# EAGLE schematic PX4Isolator (EAGLE 6.5.0)

## Sheet 1 of 4
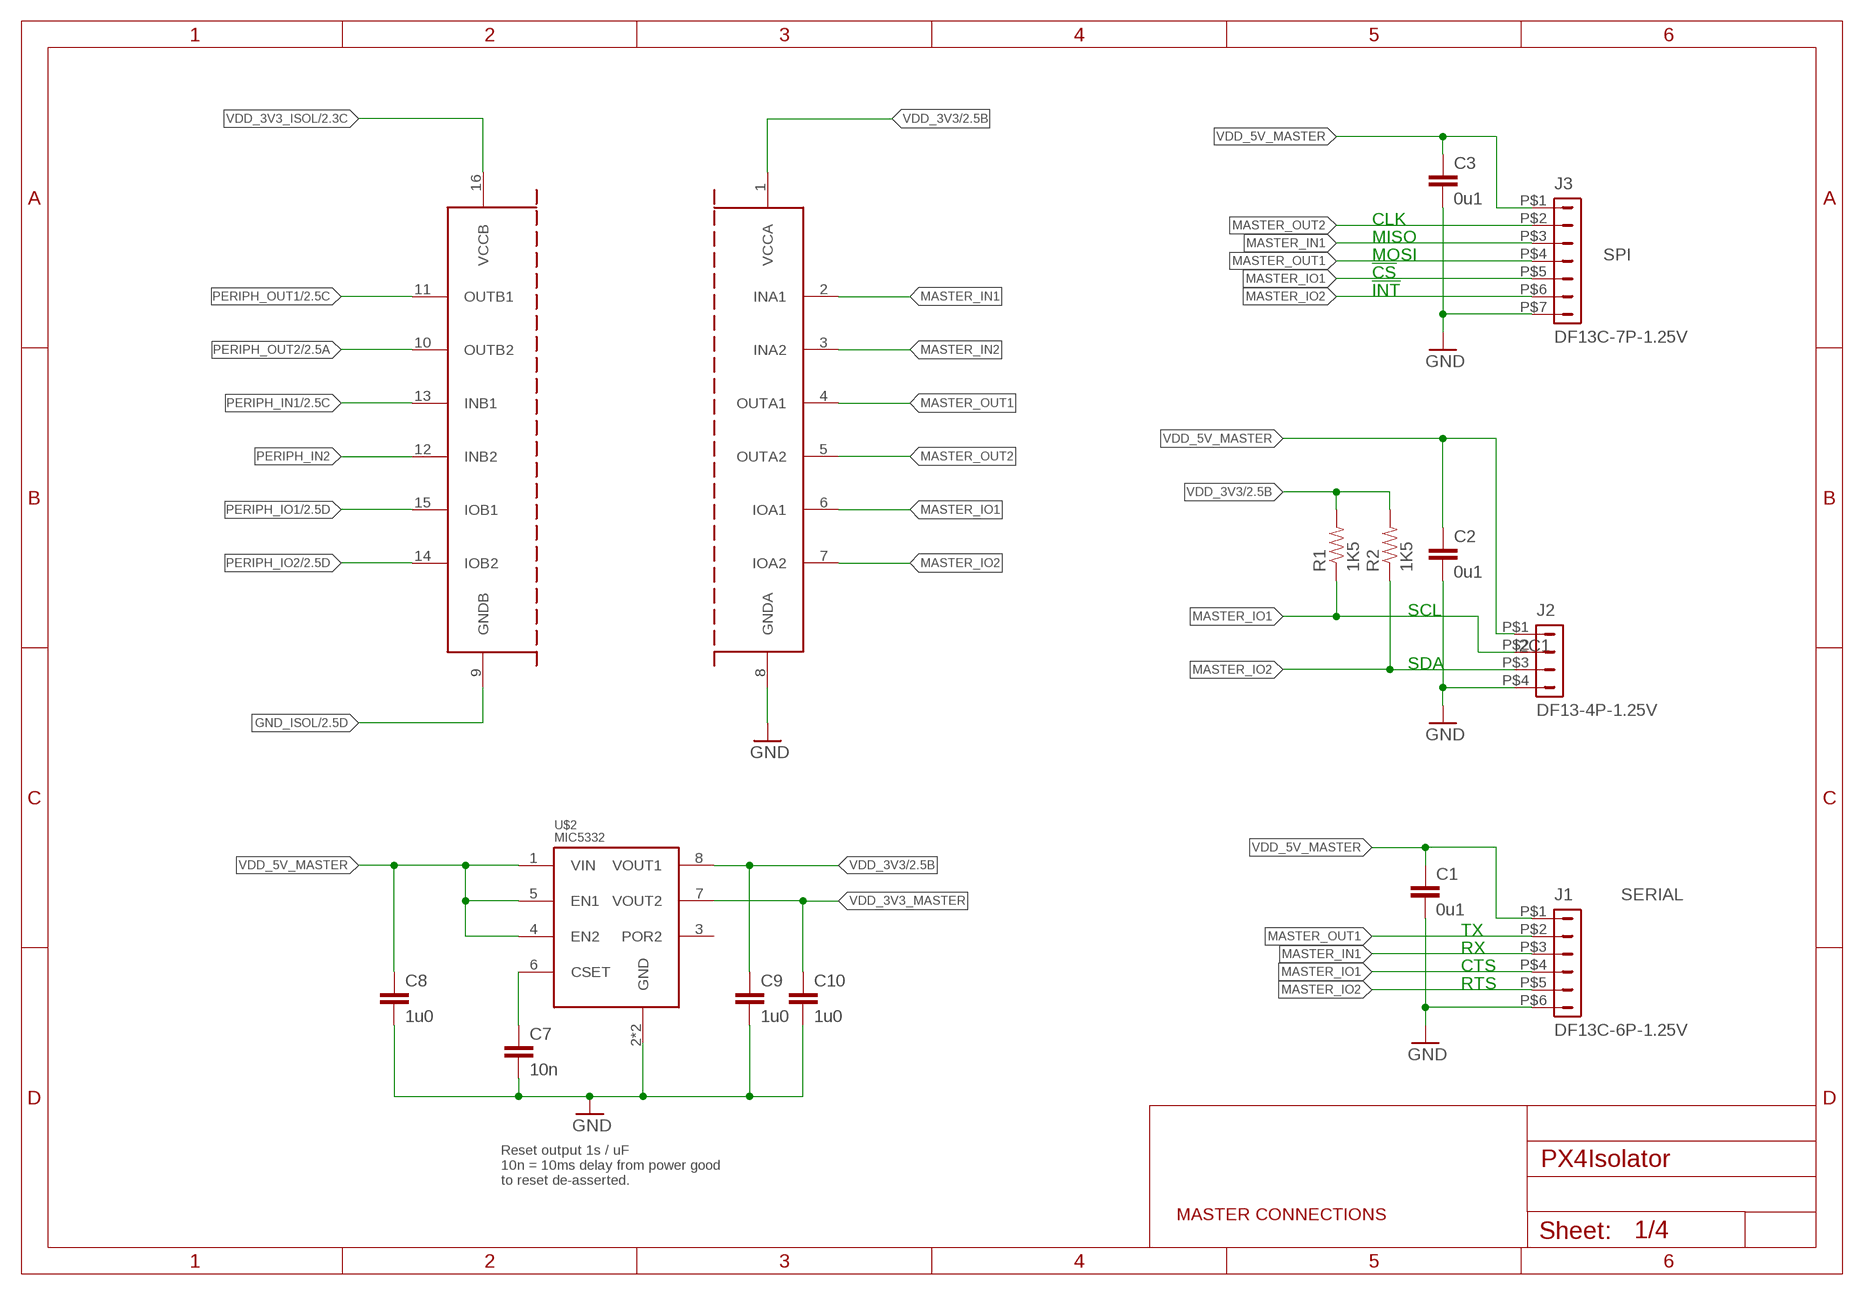
[diagram p0: schematic, sheet 1]

### Parts
C1  0u1  CAP0402  [0402-CAP]
C2  0u1  CAP0402  [0402-CAP]
C3  0u1  CAP0402  [0402-CAP]
C7  10n  CAP0402  [0402-CAP]
C8  1u0  CAP0603  [0603-CAP]
C9  1u0  CAP0603  [0603-CAP]
C10  1u0  CAP0603  [0603-CAP]
J1  DF13C-6P-1.25V  DF13-6P-1.25V  [DF13C-6P-1.25V]
J2  DF13-4P-1.25V  [DF13C-4P-1.25V]
J3  DF13C-7P-1.25V  DF13-7P-1.25V  [DF13C-7P-1.25V]
R1  1K5  RESISTOR0402-RES  [0402-RES]
R2  1K5  RESISTOR0402-RES  [0402-RES]
U$1  MAX14850  [SOIC16]
U$2  MIC5332  [MLF-8-EPAD]

### Nets
GND: C1.P$2 C2.P$2 C3.P$2 C7.P$2 C8.P$2 C9.P$2 C10.P$2 J1.P$6 J2.P$4 J3.P$7 U$1.8(GNDA) U$2.2(GND) U$2.GND ; also sheet 2,4
GND_ISOL [power]: U$1.9(GNDB) ; also sheet 2
MASTER_IN1: J1.P$3 J3.P$3 U$1.2(INA1)
MASTER_IN2: U$1.3(INA2)
MASTER_IO1: J1.P$4 J2.P$2 J3.P$5 R1.P$1 U$1.6(IOA1)
MASTER_IO2: J1.P$5 J2.P$3 J3.P$6 R2.P$1 U$1.7(IOA2)
MASTER_OUT1: J1.P$2 J3.P$4 U$1.4(OUTA1)
MASTER_OUT2: J3.P$2 U$1.5(OUTA2)
N$1: C7.P$1 U$2.6(CSET)
PERIPH_IN1: U$1.13(INB1) ; also sheet 2
PERIPH_IN2: U$1.12(INB2)
PERIPH_IO1: U$1.15(IOB1) ; also sheet 2
PERIPH_IO2: U$1.14(IOB2) ; also sheet 2
PERIPH_OUT1: U$1.11(OUTB1) ; also sheet 2
PERIPH_OUT2: U$1.10(OUTB2) ; also sheet 2
VDD_3V3 [power]: C9.P$1 R1.P$2 R2.P$2 U$1.1(VCCA) U$2.8(VOUT1) ; also sheet 2
VDD_3V3_ISOL [power]: U$1.16(VCCB) ; also sheet 2
VDD_3V3_MASTER [power]: C10.P$1 U$2.7(VOUT2)
VDD_5V_MASTER [power]: C1.P$1 C2.P$1 C3.P$1 C8.P$1 J1.P$1 J2.P$1 J3.P$1 U$2.1(VIN) U$2.4(EN2) U$2.5(EN1)
Unconnected: U$2.3(POR2)

### Notes on the sheet
- CLK
- MISO
- MOSI | SPI
- !CS
- !INT
- SCL
- I2C1
- SDA
- SERIAL
- TX
- RX
- CTS
- RTS
- Reset output 1s / uF
  10n = 10ms delay from power good
  to reset de-asserted.
- MASTER CONNECTIONS

## Sheet 2 of 4
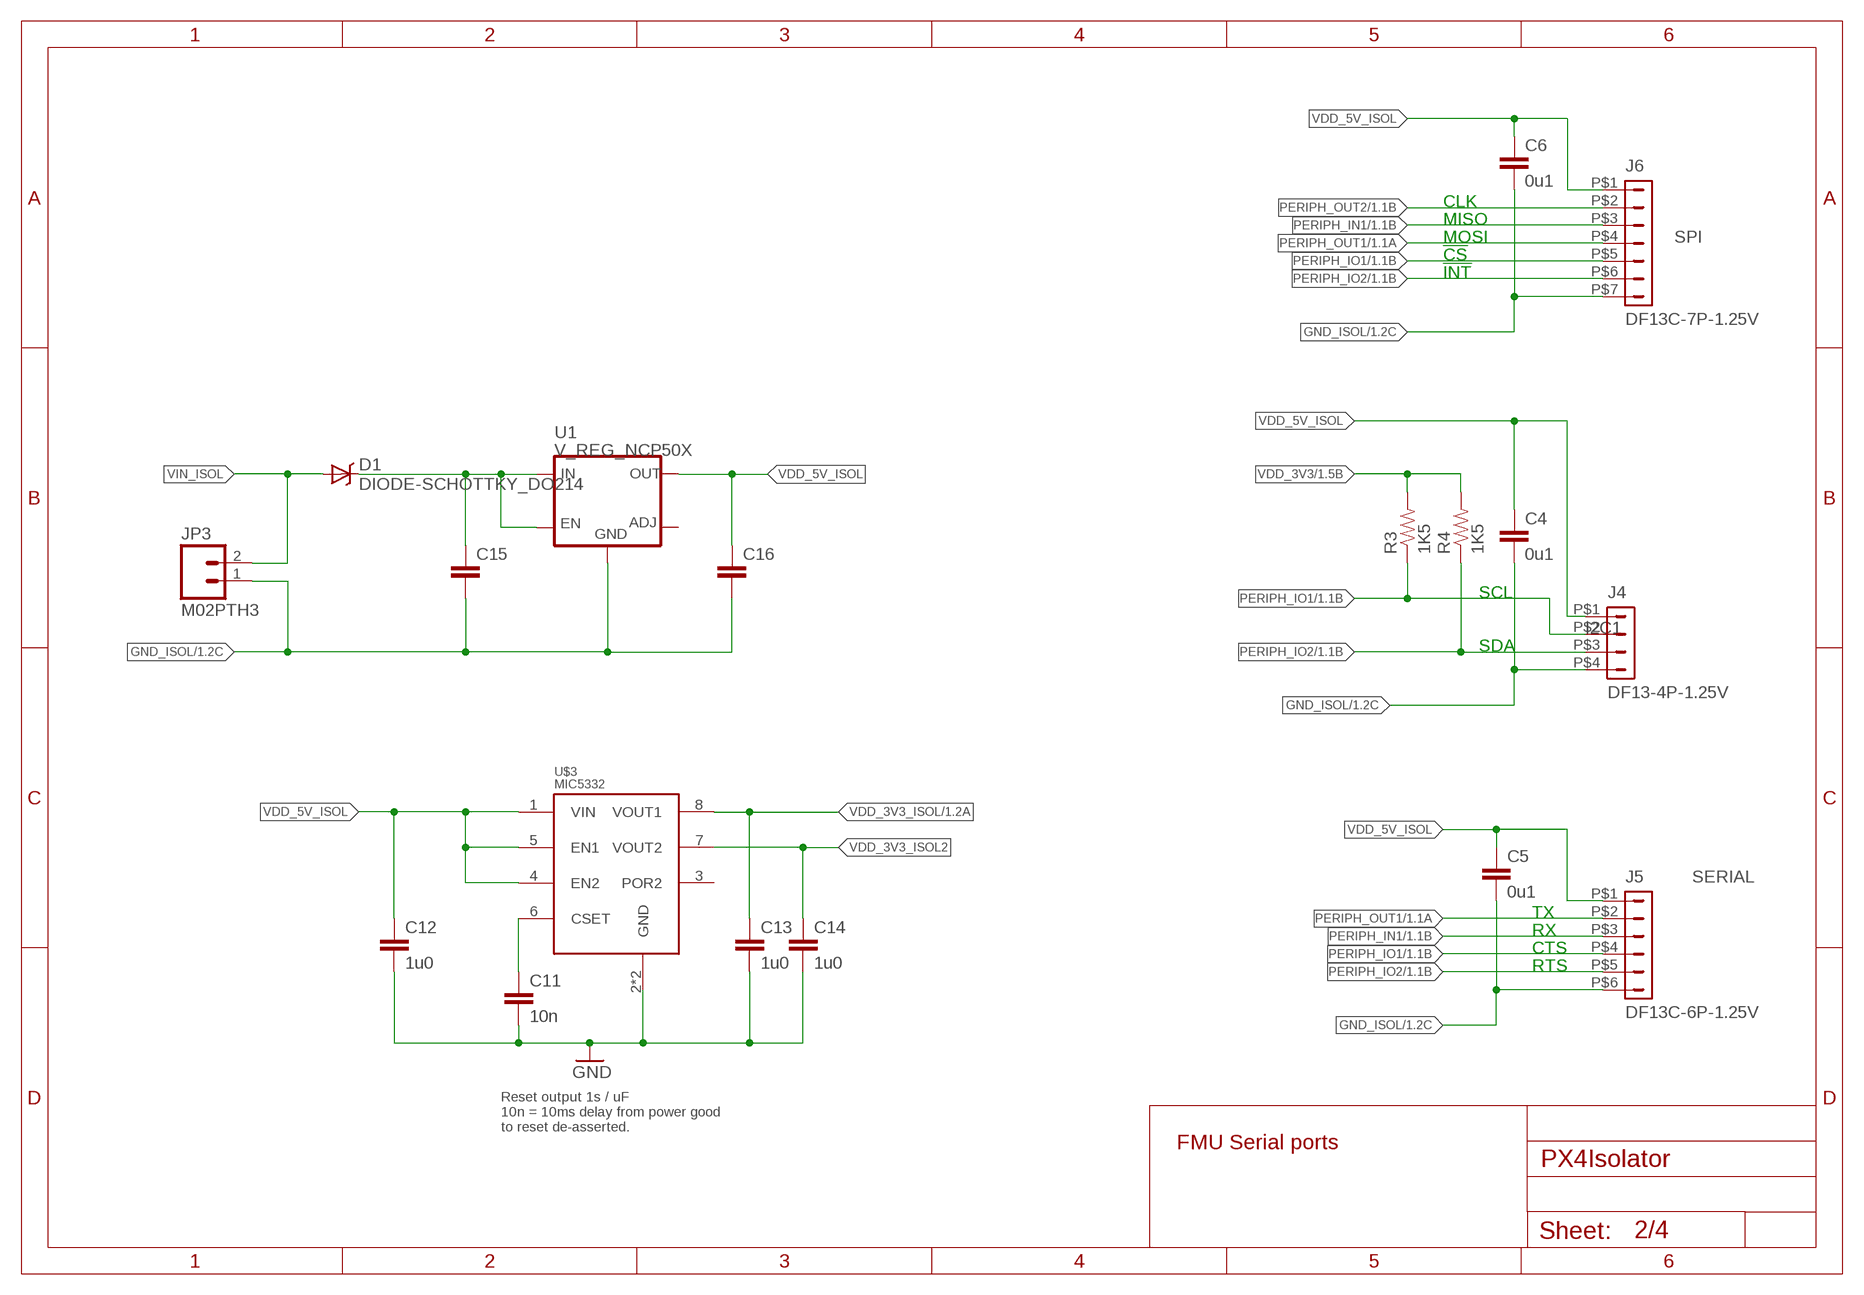
[diagram p1: schematic, sheet 2]

### Parts
C4  0u1  CAP0402  [0402-CAP]
C5  0u1  CAP0402  [0402-CAP]
C6  0u1  CAP0402  [0402-CAP]
C11  10n  CAP0402  [0402-CAP]
C12  1u0  CAP0603  [0603-CAP]
C13  1u0  CAP0603  [0603-CAP]
C14  1u0  CAP0603  [0603-CAP]
C15  CAP0603  [0603-CAP]
C16  CAP0603  [0603-CAP]
D1  DIODE-SCHOTTKY_DO214  [DO214AC]
J4  DF13-4P-1.25V  [DF13C-4P-1.25V]
J5  DF13C-6P-1.25V  DF13-6P-1.25V  [DF13C-6P-1.25V]
J6  DF13C-7P-1.25V  DF13-7P-1.25V  [DF13C-7P-1.25V]
JP3  M02PTH3  [1X02_LONGPADS]
R3  1K5  RESISTOR0402-RES  [0402-RES]
R4  1K5  RESISTOR0402-RES  [0402-RES]
U1  V_REG_NCP50X  [DPAK-5]
U$3  MIC5332  [MLF-8-EPAD]

### Nets
GND: C11.P$2 C12.P$2 C13.P$2 C14.P$2 U$3.2(GND) U$3.GND ; also sheet 1,4
GND_ISOL [power]: C4.P$2 C5.P$2 C6.P$2 C15.P$2 C16.P$2 J4.P$4 J5.P$6 J6.P$7 JP3.1 U1.GND ; also sheet 1
N$2: C11.P$1 U$3.6(CSET)
N$3: C15.P$1 D1.C U1.EN U1.VIN(IN)
PERIPH_IN1: J5.P$3 J6.P$3 ; also sheet 1
PERIPH_IO1: J4.P$2 J5.P$4 J6.P$5 R3.P$1 ; also sheet 1
PERIPH_IO2: J4.P$3 J5.P$5 J6.P$6 R4.P$1 ; also sheet 1
PERIPH_OUT1: J5.P$2 J6.P$4 ; also sheet 1
PERIPH_OUT2: J6.P$2 ; also sheet 1
VDD_3V3 [power]: R3.P$2 R4.P$2 ; also sheet 1
VDD_3V3_ISOL [power]: C13.P$1 U$3.8(VOUT1) ; also sheet 1
VDD_3V3_ISOL2 [power]: C14.P$1 U$3.7(VOUT2)
VDD_5V_ISOL [power]: C4.P$1 C5.P$1 C6.P$1 C12.P$1 C16.P$1 J4.P$1 J5.P$1 J6.P$1 U1.VOUT(OUT) U$3.1(VIN) U$3.4(EN2) U$3.5(EN1)
VIN_ISOL [power]: D1.A JP3.2
Unconnected: U1.ADJ U$3.3(POR2)

### Notes on the sheet
- CLK
- MISO
- MOSI | SPI
- !CS
- !INT
- SCL
- I2C1
- SDA
- SERIAL
- TX
- RX
- CTS
- RTS
- Reset output 1s / uF
  10n = 10ms delay from power good
  to reset de-asserted.
- FMU Serial ports

## Sheet 3 of 4
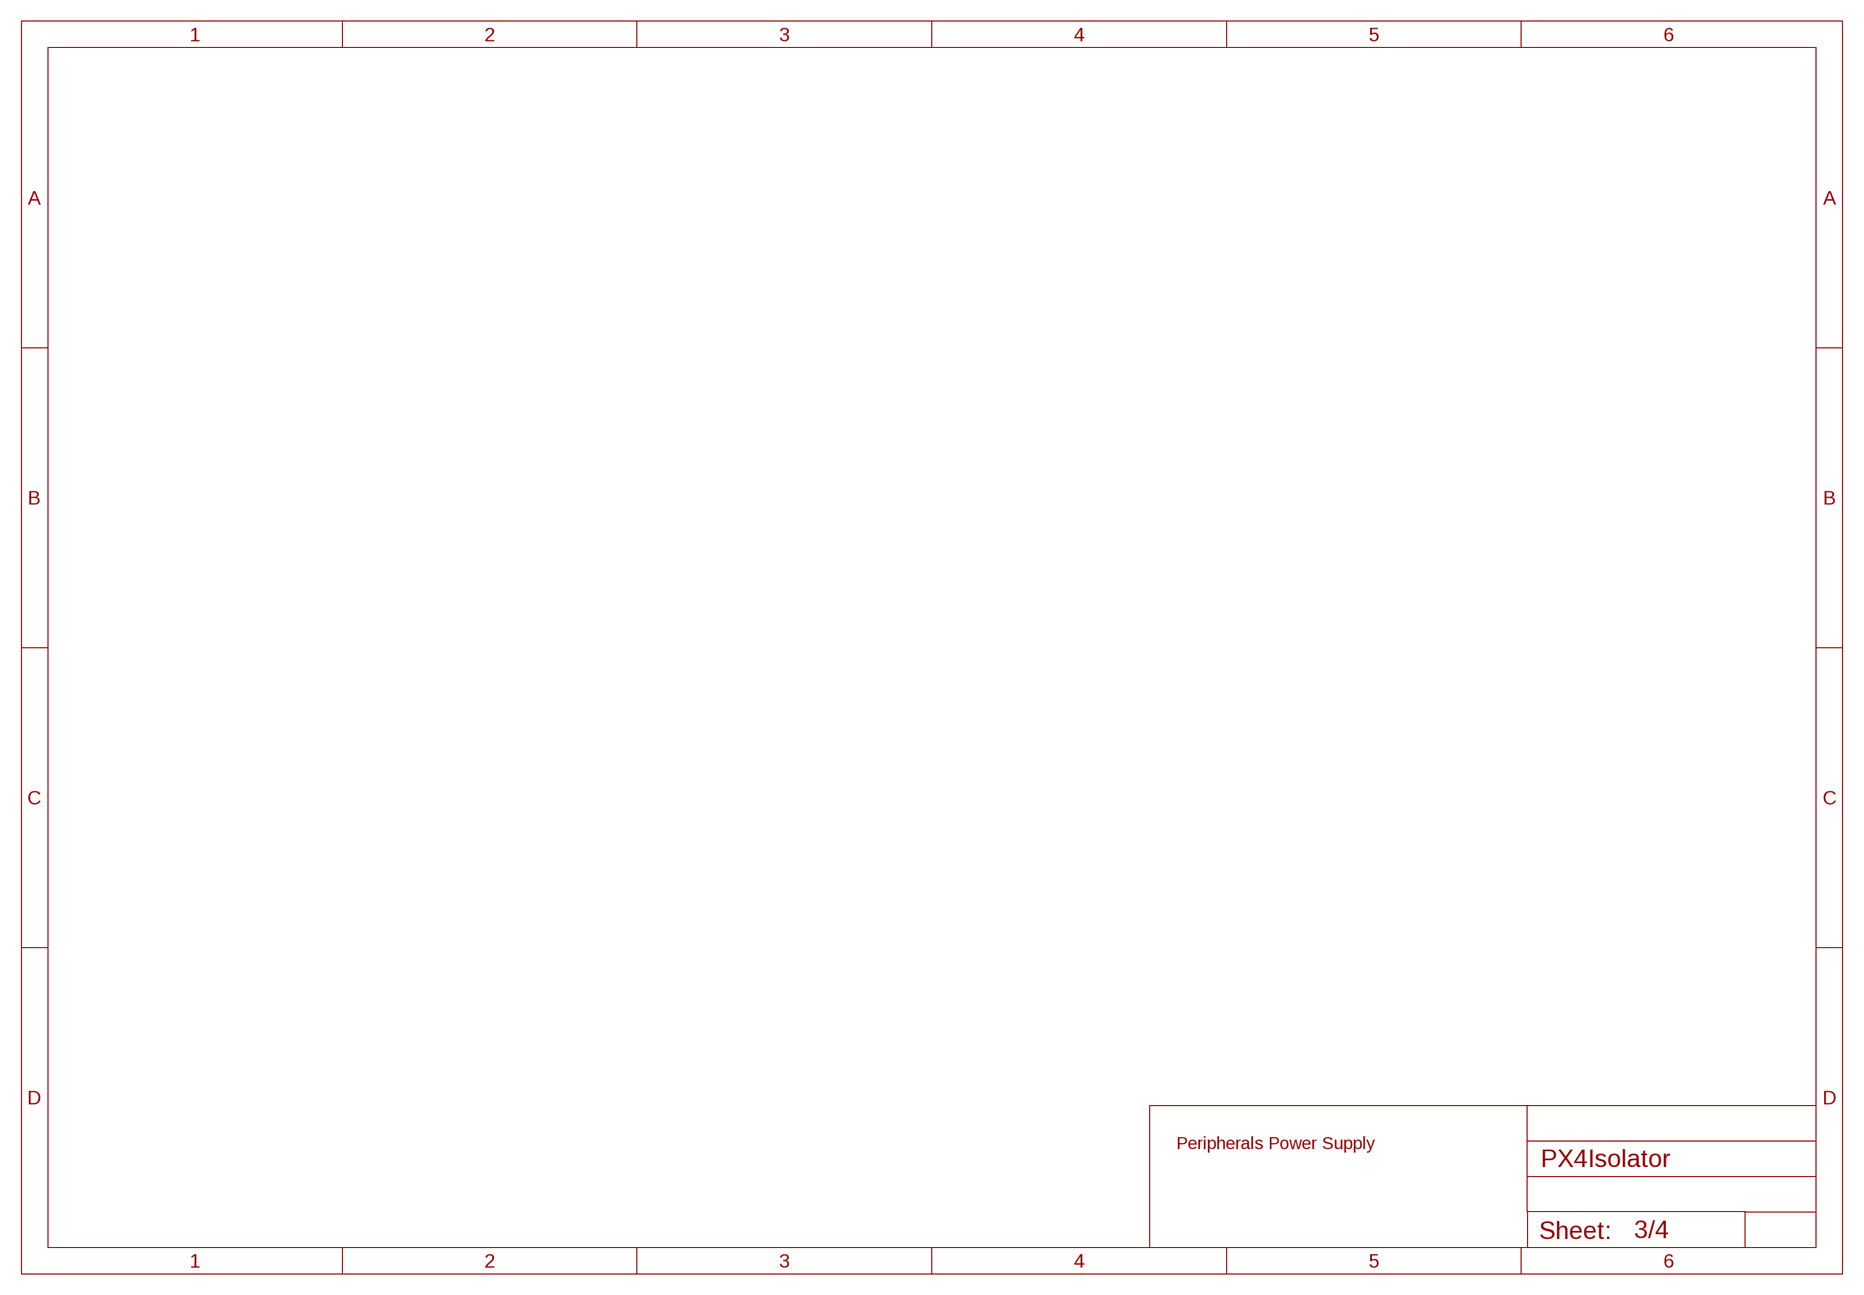
[diagram p2: schematic, sheet 3]

### Notes on the sheet
- Peripherals Power Supply

## Sheet 4 of 4
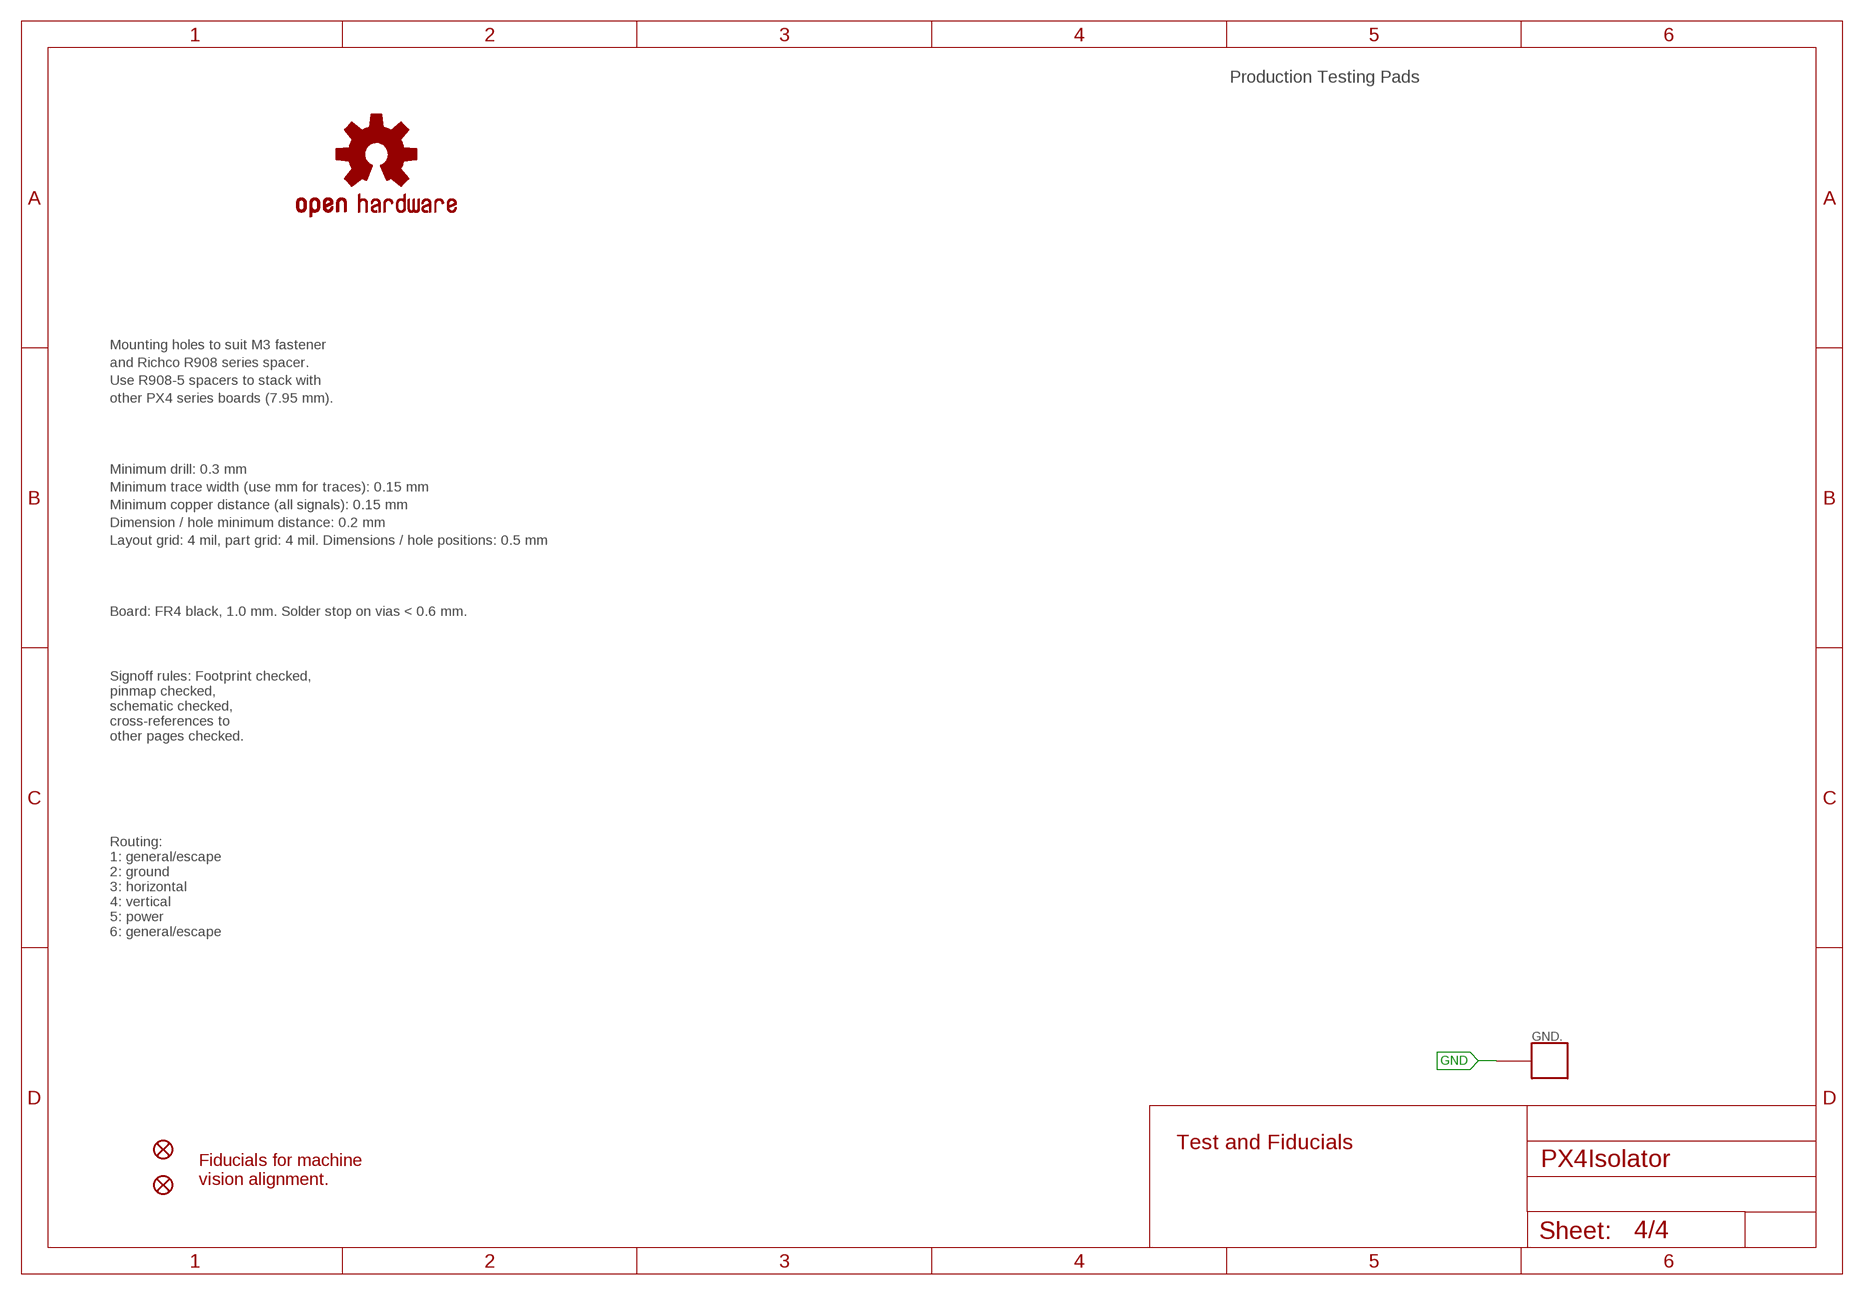
[diagram p3: schematic, sheet 4]

### Parts
GND.  PAD.04  [PAD.04X.04]
JP1  FIDUCIAL1.5X3  [FIDUCIAL-1.5X3]
JP2  FIDUCIAL1.5X3  [FIDUCIAL-1.5X3]
OSHW_LOGO  OSHW-LOGOS  [OSHW-LOGO-S]

### Nets
GND: GND..P$1 ; also sheet 1,2

### Notes on the sheet
- Production Testing Pads
- Mounting holes to suit M3 fastener
- and Richco R908 series spacer.
- Use R908-5 spacers to stack with
- other PX4 series boards (7.95 mm).
- Minimum drill: 0.3 mm
- Minimum trace width (use mm for traces): 0.15 mm
- Minimum copper distance (all signals): 0.15 mm
- Dimension / hole minimum distance: 0.2 mm
- Layout grid: 4 mil, part grid: 4 mil. Dimensions / hole positions: 0.5 mm
- Board: FR4 black, 1.0 mm. Solder stop on vias < 0.6 mm.
- Signoff rules: Footprint checked,
  pinmap checked,
  schematic checked, 
  cross-references to
  other pages checked.
- Routing:
  1: general/escape
  2: ground
  3: horizontal
  4: vertical
  5: power
  6: general/escape
- Test and Fiducials
- Fiducials for machine
  vision alignment.

## Library data of the parts
C1-C6 = pixhawk2:CAP: Capacitor Standard 0603 ceramic capacitor, and 0.1" leaded capacitor.; PARTNO: CC0402ZRY5V7BB104
C7 C11 = pixhawk2:CAP: Capacitor Standard 0603 ceramic capacitor, and 0.1" leaded capacitor.; PARTNO: CC0402KRX7R7BB103
C8-C10 C12-C14 = pixhawk2:CAP: Capacitor Standard 0603 ceramic capacitor, and 0.1" leaded capacitor.; PARTNO: CC0603ZRY5V7BB105
C15 C16 = PX4FMUlite_V0_1:CAP: Capacitor Standard 0603 ceramic capacitor, and 0.1" leaded capacitor.
D1 = PX4FMUlite_V0_1:DIODE-SCHOTTKY: Schottky barrier diode in DO214AC, e.g. Fairchild SS14.
GND. = pixhawk2:PAD: Test pad This footprint includes three classes: The actual test pads, a pogo-pin footprint to mount the pogo-pin as through-hole part and a hole footprint which allows the head of the pogo-pin to pass through (do NOT use the hole to mount the pogo-pin). In a typical test setup, the stack would consist of three PCBs: The actual PCB under testing with a test pad on the bottom, then a second PCB with the hole for the pogo-pin head where the PCB under testing is pressed on and a third PCB at 30 mm / 1.2" distance with the pogo-pin footprints. The pogo-pins are soldered to the last PCB. To create the stack, copy the board under testing and exchange the footprints - this way the correct positioning is ensured.; BOM: EXCLUDE; PARTNO: *
J1 J5 = con-hirose-df13:DF13-6P-1.25: DF13-6P 1.25mm Pitch Miniature Crimping Connector.; PARTNO: DF13C-6P-1.25V(20)
J2 J4 = con-hirose-df13:DF13-4P-1.25: DF13-4P 1.25mm Pitch Miniature Crimping Connector.; PARTNO: DF13C-4P-1.25V(20)
J3 J6 = con-hirose-df13:DF13-7P-1.25: DF13-7P 1.25mm Pitch Miniature Crimping Connector.; PARTNO: DF13C-7P-1.25V(20)
JP1 JP2 = pixhawk2:FIDUCIAL: Fiducial Alignment Points Various fiducial points for machine vision alignment.; BOM: EXCLUDE; PARTNO: *
JP3 = SparkFun-Connectors:M02: Standard 2-pin 0.1" header. Use with - straight break away headers ( PRT-00116) - right angle break away headers (PRT-00553) - swiss pins (PRT-00743) - machine pins (PRT-00117) - female headers (PRT-00115) Molex polarized connector foot print use with: PRT-08233 with associated crimp pins and housings. 2.54_SCREWTERM for use with PRT-10571. 3.5mm Screw Terminal footprints for PRT-08084 5mm Screw Terminal footprints for use with PRT-08433
OSHW_LOGO = pixhawk2:OSHW-LOGO: Open Source Hardware Logo This logo indicates the piece of hardware it is found on incorporates a OSHW license and/or adheres to the definition of open source hardware found here: http://freedomdefined.org/OSHW; BOM: EXCLUDE; PARTNO: *
R1-R4 = pixhawk2:RESISTOR: Resistor Basic schematic elements and footprints for 0603, 1206, and PTH 1/10th watt (small) resistors.; PARTNO: RC0402FR-071K5L
U1 = SparkFun-PowerIC:V_REG_NCP50X: NCP550x 500mA LDO Voltage Regulator
U$1 = PX4lite:MAX14850
U$2 U$3 = pixhawk2:MIC5332; PARTNO: MIC5332-SSYMT

## Net classes
0 signal: width 0.152 mm, drill 0.2 mm, clearance 0.152 mm
1 power: width 0.254 mm, drill 0.3 mm, clearance 0.152 mm